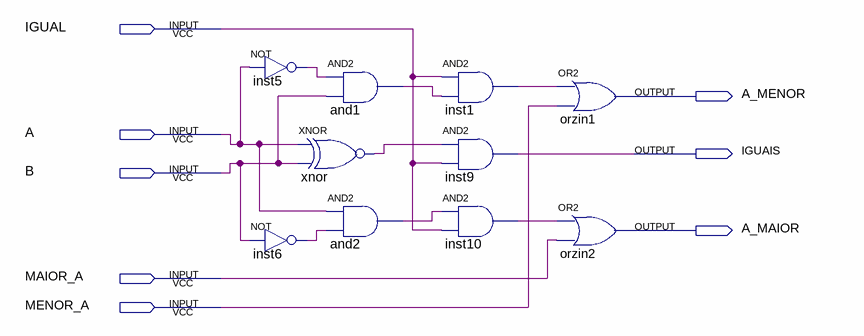
[diagram p0: schematic sheet]
// Quartus schematic comparador.bdf as structural Verilog: 10 symbols, 8 pins
module comparador (
  input  IGUAL,
  input  A,
  input  B,
  input  MAIOR_A,
  input  MENOR_A,
  output A_MENOR,
  output IGUAIS,
  output A_MAIOR
);

  wire and1_out, and2_out, inst1_out, inst5_out, inst6_out, inst10_out, xnor_out;

  not inst5 (inst5_out, A);
  not inst6 (inst6_out, B);
  and and1 (and1_out, inst5_out, B);
  xnor \xnor  (xnor_out, A, B);
  and and2 (and2_out, A, inst6_out);
  and inst1 (inst1_out, IGUAL, and1_out);
  and inst9 (IGUAIS, xnor_out, IGUAL);
  and inst10 (inst10_out, and2_out, IGUAL);
  or orzin1 (A_MENOR, inst1_out, MENOR_A);
  or orzin2 (A_MAIOR, inst10_out, MAIOR_A);
endmodule
